# Altium project 3v_i2c_Bean_OLED.PrjPCB
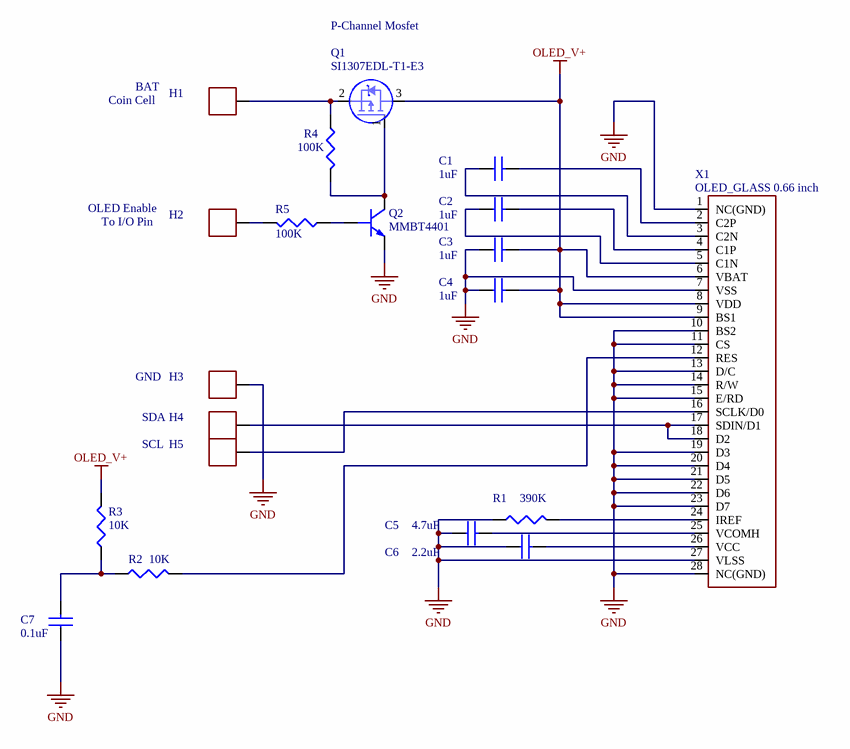
[diagram p0: 3v_i2c_Bean_OLED_Rev1.1.SchDoc]
PrjCustomer: Tindie; PrjDrawnBy: MAR; PrjEngineer: MAR; PrjRevision: Rev1.1; PrjStartDate: 2013/05/23; PrjTitle: OLED; PrjTitle2: 3.3V OLED
1 sheet, 20 parts. Net scope: global (net labels, ports and power ports of the same name join across sheets).
Board file: 3v_i2c_Bean_OLED_Rev1.1.PcbDoc

## Sheet 3v_i2c_Bean_OLED_Rev1.1.SchDoc
size A2; CompanyName: OMNITECH ELECTRONICS INCORPORATED; Organization: Omnitech Electronics Inc.; Address1: 1-10 Akerley Blvd, Dartmouth, Nova Scotia, Canada B3B 1J4; Address2: (902) 468-5911, FAX (902) 468-5912; Address3: www.omnitechelectronics.ca; SheetTotal: 5; PageSetup: Record=PageOptions|CenterHorizontal=True|CenterVertical=True|PrintScale=0.67|XCorrection=1.00|YCorrection=1.00|PrintKind=1|BorderSize=5000000|LeftOffset=0|BottomOffset=0|Orientation=2|PaperLength=1000|PaperWidth=1000|Scale=100|PaperSource=15|PrintQuality=600|MediaType=1|DitherType=10|PaperKind=11x17|PrintScaleMode=1

### Parts
C1  1uF  [CAPC1608X09L]
C2  1uF  [CAPC1608X09L]
C3  1uF  [CAPC1608X09L]
C4  1uF  [CAPC1608X09L]
C5  4.7uF  [CAPC1608X09L]
C6  2.2uF  [CAPC1608X09L]
C7  0.1uF  [CAPC1608X09L]
H1  CON1  [HDR1X1]  (value not drawn)
H2  CON1  [HDR1X1]  (value not drawn)
H3  CON1  [HDR1X1]  (value not drawn)
H4  CON1  [HDR1X1]  (value not drawn)
H5  CON1  [HDR1X1]  (value not drawn)
Q1  (no value)  [SC70-LB3_N]
Q2  MMBT4401  [SOT95P240X110-3N]
R1  390K  [RESC1608X06L]
R2  10K  [RESC1608X06L]
R3  10K  [RESC1608X06L]
R4  100K  [RESC1608X06L]
R5  100K  [RESC1608X06L]
X1  OLED_GLASS 0.66 inch  [OLED_GLASS 0.66 INCH]

### Nets
GND: C3.1 C4.1 C5.1 C6.1 C7.1 H3.1 Q2.2(E) R1.1 X1.1(NC(GND)) X1.7(VSS) X1.10(BS2) X1.11(CS) X1.13(D/C) X1.14(R/W) X1.15(E/RD) X1.19(D3) X1.20(D4) X1.21(D5) X1.22(D6) X1.23(D7) X1.27(VLSS) X1.28(NC(GND))
OLED_V+: C3.2 C4.2 Q1.3(D) R3.2 X1.6(VBAT) X1.8(VDD) X1.9(BS1)
NetC1_1: C1.1 X1.3(C2N)
NetC1_2: C1.2 X1.2(C2P)
NetC2_1: C2.1 X1.5(C1N)
NetC2_2: C2.2 X1.4(C1P)
NetC5_2: C5.2 X1.25(VCOMH)
NetC6_2: C6.2 X1.26(VCC)
NetC7_2: C7.2 R2.1 R3.1
NetH1_1: H1.1 Q1.2(S) R4.1
NetH2_1: H2.1 R5.2
NetH4_1: H4.1 X1.17(SDIN/D1) X1.18(D2)
NetH5_1: H5.1 X1.16(SCLK/D0)
NetQ1_1: Q1.1(G) Q2.3(C) R4.2
NetQ2_1: Q2.1(B) R5.1
NetR1_2: R1.2 X1.24(IREF)
NetR2_2: R2.2 X1.12(RES)

### Notes on the sheet
- P-Channel Mosfet
- Coin Cell
- BAT
- OLED Enable
- To I/O Pin
- GND
- SDA
- SCL

### Library data of the parts
C1-C7 = CAP_0603: CAP 0603
  C1-C4: Value: 1uF
  C5: Value: 4.7uF
  C6: Value: 2.2uF
  C7: Value: 0.1uF
H1-H5 = CON1: CONN HEADER 1POS .100" PADS; PartNumber: PADS
Q1 = SI1307EDL-T1-E3: MOSFET P-CH 12V 850MA SOT323-3; Manufacturer: Vishay; Vendor: Digikey; PartNumber: SI1307EDL-T1-E3
Q2 = MMBT4401: TRANSISTOR GP NPN AMP SOT-23; Manufacturer: Fairchild Semi; Vendor: Digikey; PartNumber: MMBT4401
R1-R3 = RES_0603: RES 0603
  R1: Value: 390K
  R2 R3: Value: 10K
R4 R5 = RES_0603: RES 100K OHM 1/10W 1% 0603 SMD; Value: 100K
X1 = OLED_GLASS 0.66 inch: 0.66 inch OLED_GLASS; Vendor: Buy-Display; PartNumber: N/A; Manufacturer: N/A